# EAGLE schematic emonDCduo-ESP v4.1 (EAGLE 9.3.2)
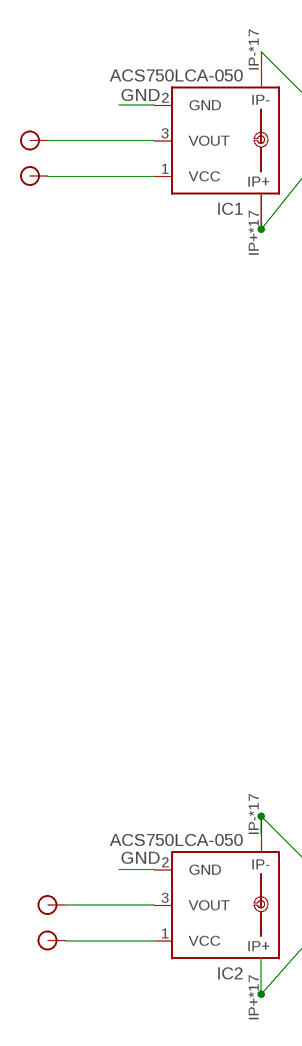
[diagram p0: schematic, sheet 1, part 1 of 2]
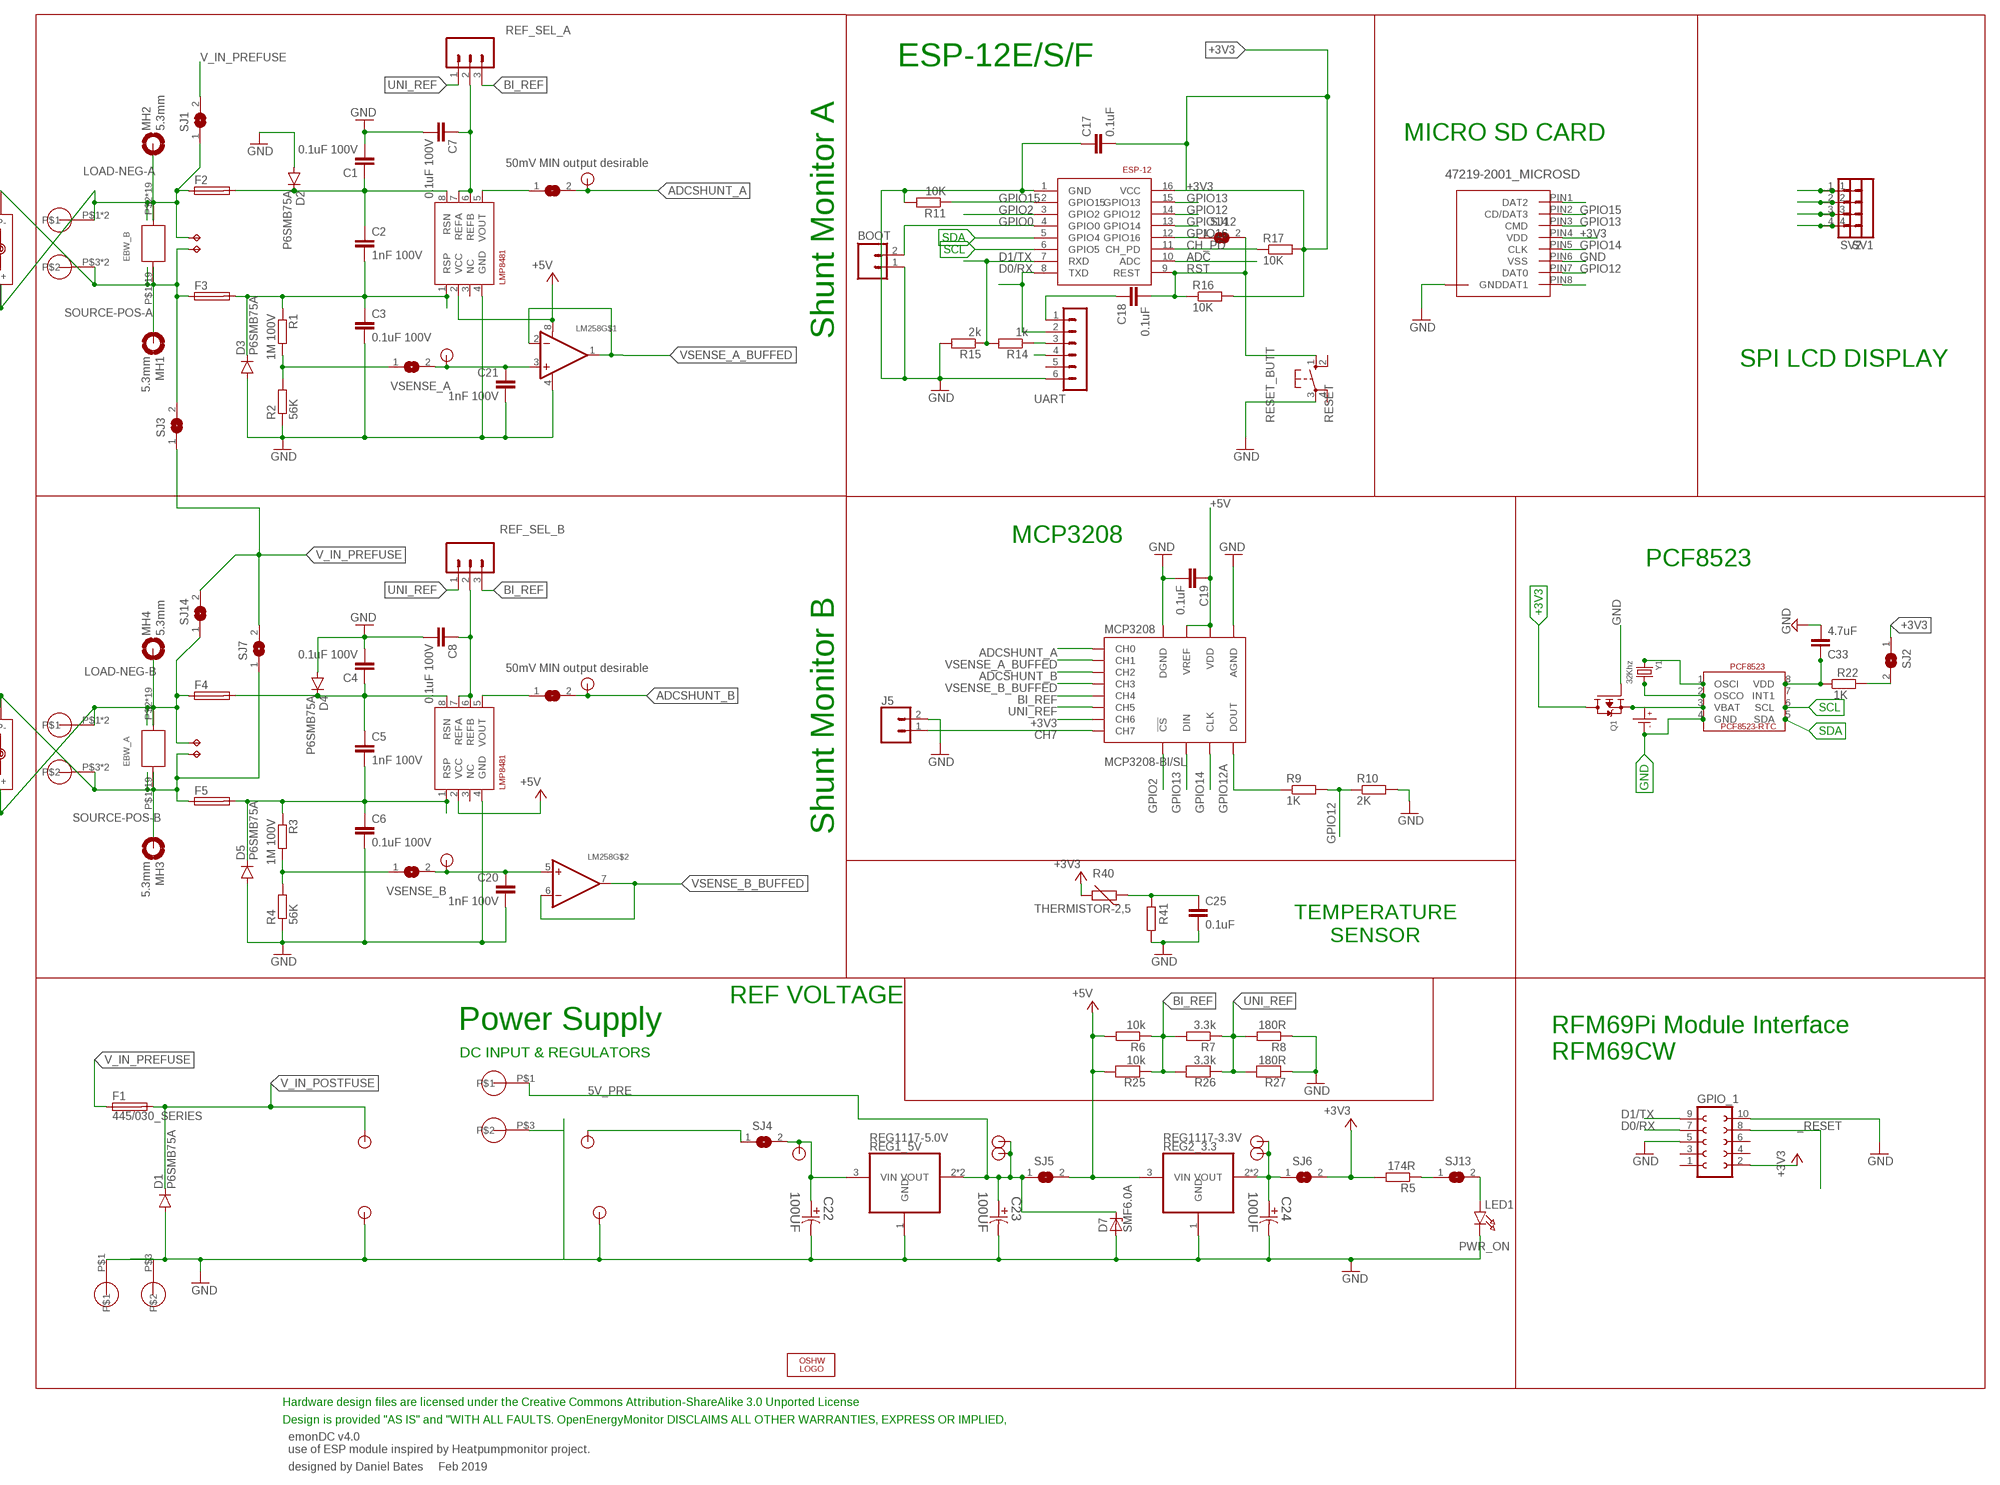
[diagram p1: schematic, sheet 1, part 2 of 2]

## Parts
BOOT  M02PTH  [1X02]
C1  0.1uF 100V  C-EUC0805  [C0805]
C2  1nF 100V  C-EUC0805  [C0805]
C3  0.1uF 100V  C-EUC0805  [C0805]
C4  0.1uF 100V  C-EUC0805  [C0805]
C5  1nF 100V  C-EUC0805  [C0805]
C6  0.1uF 100V  C-EUC0805  [C0805]
C7  0.1uF 100V  C-EUC0805  [C0805]
C8  0.1uF 100V  C-EUC0805  [C0805]
C17  0.1uF  C-EUC0805  [C0805]
C18  0.1uF  C-EUC0805  [C0805]
C19  0.1uF  C-EUC0805  [C0805]
C20  1nF 100V  C-EUC0805  [C0805]
C21  1nF 100V  C-EUC0805  [C0805]
C22  100UF  EEE-0JA101WAR-CASE-C  [CAPAE530X610N]
C23  100UF  EEE-0JA101WAR-CASE-C  [CAPAE530X610N]
C24  100UF  EEE-0JA101WAR-CASE-C  [CAPAE530X610N]
C25  0.1uF  C-EUC0805  [C0805]
C33  4.7uF  C-EUC0805  [C0805]
CR1220  CR1220SMD  [CR1220SMD]
D1  P6SMB75A  DIODE-DO214AA  [DO214AA]
D2  P6SMB75A  DIODE-SMB  [SMB]
D3  P6SMB75A  DIODE-SMB  [SMB]
D4  P6SMB75A  DIODE-SMB  [SMB]
D5  P6SMB75A  DIODE-SMB  [SMB]
D7  SMF6.0A  [SOD123F]
EBW_A  EBW_SERIES_15.2MM  [EBW_SERIES_15.2MM]
EBW_B  EBW_SERIES_15.2MM  [EBW_SERIES_15.2MM]
ESP-12  ESP8266_ESP-12  [ESP8266-ESP12]
F1  445/030_SERIES  [445/030_SERIES_LITTELFUSE]
F2  TR5  [TR5]
F3  TR5  [TR5]
F4  TR5  [TR5]
F5  TR5  [TR5]
GPIO_1  FE05-2_RFM69PI_OUTLINERFM69PI  [FE05-2_RFM69PI_OULTINE]
IC1  ACS750LCA-050  [ACS75050]
IC2  ACS750LCA-050  [ACS75050]
J5  CONN_02  [1X02]
LED1  PWR_ON  LED1206  [CHIPLED_1206]
LM258  LM358  [SOIC8_150MIL]
LOGO1  OSHW_LOGO_6MILX0200-NT  [OSHW_6X200_NOTEXT]
MCP3208  MCP3208-BI/SL  [SOIC16]
MH1  5.3mm  MOUNT-PAD-ROUND5.3  [5,3//11-PAD]
MH2  5.3mm  MOUNT-PAD-ROUND5.3  [5,3//11-PAD]
MH3  5.3mm  MOUNT-PAD-ROUND5.3  [5,3//11-PAD]
MH4  5.3mm  MOUNT-PAD-ROUND5.3  [5,3//11-PAD]
MICRO_SD  47219-2001_MICROSD  [47219-2001_MICROSD]
MOUNT_10.16_A  MOLEX_39970-003  [2/10,16]
MOUNT_10.16_B  MOLEX_39970-003  [2/10,16]
PCF8523  PCF8523_RTC  [SOIC_8]
Q1  MOSFET-P  [SOT23-R]
R1  1M 100V  R-EU_0207/2V  [0207/2V]
R2  56K  R-EU_0207/2V  [0207/2V]
R3  1M 100V  R-EU_0207/2V  [0207/2V]
R4  56K  R-EU_0207/2V  [0207/2V]
R5  174R  R-EU_R0603  [R0603]
R6  10k  R-EU_0207/10  [0207/10]
R7  3.3k  R-EU_0207/10  [0207/10]
R8  180R  R-EU_0207/10  [0207/10]
R9  1K  R-EU_R0603  [R0603]
R10  2K  R-EU_R0603  [R0603]
R11  10K  R-EU_R0603  [R0603]
R14  1k  R-EU_R0603  [R0603]
R15  2k  R-EU_R0603  [R0603]
R16  10K  R-EU_R0603  [R0603]
R17  10K  R-EU_R0603  [R0603]
R22  1K  R-EU_R0603  [R0603]
R25  10k  RESISTOR0603  [0603]
R26  3.3k  RESISTOR0603  [0603]
R27  180R  RESISTOR0603  [0603]
R40  THERMISTOR-2,5  [RS-2,5]
R41  R-EU_0207/2V  [0207/2V]
REF_SEL_A  455-1750-1-ND  CONN_03  [1X03]
REF_SEL_B  455-1750-1-ND  CONN_03  [1X03]
REG1_5V  REG1117-5.0V  REG1117  [SOT223]
REG2_3.3  REG1117-3.3V  REG1117  [SOT223]
RESET  RESET_BUTT  10-XX  [B3F-10XX]
SHUNTMON-A  LMP8481  LMP8481-H  [S-PDSO-G08]
SHUNTMON-B  LMP8481  LMP8481-H  [S-PDSO-G08]
SJ1  SJW  [SJW]
SJ2  SOLDERJUMPERCLOSED  [SOLDERJUMPER_CLOSEDWIRE]
SJ3  SJW  [SJW]
SJ4  SOLDERJUMPERCLOSED  [SOLDERJUMPER_CLOSEDWIRE]
SJ5  SOLDERJUMPERCLOSED  [SOLDERJUMPER_CLOSEDWIRE]
SJ6  SOLDERJUMPERCLOSED  [SOLDERJUMPER_CLOSEDWIRE]
SJ7  SJW  [SJW]
SJ8  SOLDERJUMPERCLOSED  [SOLDERJUMPER_CLOSEDWIRE]
SJ9  SOLDERJUMPERCLOSED  [SOLDERJUMPER_CLOSEDWIRE]
SJ10  SOLDERJUMPERCLOSED  [SOLDERJUMPER_CLOSEDWIRE]
SJ11  SOLDERJUMPERCLOSED  [SOLDERJUMPER_CLOSEDWIRE]
SJ12  SOLDERJUMPERCLOSED  [SOLDERJUMPER_CLOSEDWIRE]
SJ13  SOLDERJUMPERCLOSED  [SOLDERJUMPER_CLOSEDWIRE]
SJ14  SJW  [SJW]
SV1  MA04-1  [MA04-1]
SV2  MA04-1  [MA04-1]
TP8  TPPAD1-13Y  [P1-13Y]
TP9  TPPAD1-13Y  [P1-13Y]
TP10  TPPAD1-13Y  [P1-13Y]
TP11  TPPAD1-13Y  [P1-13Y]
U$1  TP0.8MM  [TP0.8]
U$2  2212S-02SG-85  TP_2_LONG  [TP0.8_X2]
U$3  2212S-02SG-85  TP_2_LONG  [TP0.8_X2]
U$4  TP0.8MM  [TP0.8]
U$5  TP0.8MM  [TP0.8]
U$6  TP0.8MM  [TP0.8]
U$7  TP0.8MM  [TP0.8]
U$8  TP0.8MM  [TP0.8]
U$9  TP0.8MM  [TP0.8]
U$10  2212S-02SG-85  TP_2_LONG  [TP0.8_X2]
U$11  2212S-02SG-85  TP_2_LONG  [TP0.8_X2]
U$12  5MMBLOCK  [2/5.08]
U$13  5MMBLOCK  [2/5.08]
U$14  TP0.8MM  [TP0.8]
U$15  TP0.8MM  [TP0.8]
U$16  TP0.8MM  [TP0.8]
U$17  TP0.8MM  [TP0.8]
U$18  TP0.8MM  [TP0.8]
U$19  TP0.8MM  [TP0.8]
UART  UART  MA06-1  [MA06-1]
Y1  32Khz  CRYSTAL8X3.8SMT  [CRYSTAL_8X3.8]

## Nets
3.3V_PRE [thin_power]: C24.1 REG2_3.3.2(VOUT) REG2_3.3.4(VOUT) SJ6.1 U$8.P$1 U$19.P$1
5V_PRE [thin_power]: C23.1 D7.C REG1_5V.2(VOUT) REG1_5V.4(VOUT) SJ5.1 U$7.P$1 U$12.P$1 U$18.P$1
6.5V [thin_power]: C22.1 REG1_5V.3(VIN) SJ4.2 U$9.P$1
+3V3 [thin_power2]: C17.2 ESP-12.16(VCC) GPIO_1.2 MCP3208.7(CH6) MICRO_SD.PIN4(VDD) Q1.3(D) R5.2 R16.2 R17.2 R40.2 SJ2.1 SJ6.2 SV1.3 SV2.3
+5V [thin_power2]: C19.1 LM258.8(V+) MCP3208.15(VREF) MCP3208.16(VDD) R6.2 R25.2 REG2_3.3.3(VIN) SHUNTMON-A.2(VCC) SHUNTMON-B.2(VCC) SJ5.2 UART.4
_RESET: GPIO_1.8
ADC: C25.1 ESP-12.10(ADC) R40.1 R41.2
ADCSHUNT_A: MCP3208.1(CH0) SJ11.2 U$6.P$1
ADCSHUNT_B: MCP3208.3(CH2) SJ10.2 U$5.P$1
BI_REF: MCP3208.5(CH4) R6.1 R7.2 R25.1 R26.2 REF_SEL_A.3 REF_SEL_B.3
CH7: J5.1 MCP3208.8(CH7)
CH_PD: ESP-12.11(CH_PD) R17.1
D0/RX: ESP-12.8(TXD) GPIO_1.7 UART.2
D1/TX: ESP-12.7(RXD) GPIO_1.9 R14.2 R15.1
GND: BOOT.1 C1.2 C3.2 C4.2 C6.2 C7.2 C8.2 C17.1 C19.2 C20.2 C21.2 C22.2 C23.2 C24.2 C25.2 C33.2 CR1220.P-(P$-) D1.A D2.A D3.A D4.A D5.A D7.A ESP-12.1(GND) GPIO_1.5 GPIO_1.10 IC1.2(GND) IC2.2(GND) J5.2 LED1.C LM258.4(V-) MCP3208.9(DGND) MCP3208.14(AGND) MICRO_SD.P$1(GND) MICRO_SD.P$2(GND) MICRO_SD.P$3(GND) MICRO_SD.P$4(GND) MICRO_SD.PIN6(VSS) PCF8523.4(GND) Q1.1(G) R2.1 R4.1 R8.1 R10.2 R11.2 R15.2 R27.1 R41.1 REG1_5V.1(GND) REG2_3.3.1(GND) RESET.3(P) SHUNTMON-A.4(GND) SHUNTMON-B.4(GND) SV1.4 SV2.4 U$3.P$1 U$3.P$2 U$11.P$1 U$11.P$2 U$12.P$3 U$13.P$1 U$13.P$3 UART.6
GPIO0: BOOT.2 ESP-12.4(GPIO0)
GPIO2: ESP-12.3(GPIO2) MCP3208.10(!CS)
GPIO12: ESP-12.14(GPIO12) MICRO_SD.PIN7(DAT0) R9.2 R10.1
GPIO12A: MCP3208.12(DOUT) R9.1
GPIO13: ESP-12.15(GPIO13) MCP3208.11(DIN) MICRO_SD.PIN3(CMD)
GPIO14: ESP-12.13(GPIO14) MCP3208.13(CLK) MICRO_SD.PIN5(CLK)
GPIO15: ESP-12.2(GPIO15) MICRO_SD.PIN2(CD/DAT3) R11.1
GPIO16: ESP-12.12(GPIO16) SJ12.1
LOAD-NEG-A [HV]: EBW_B.P$2 EBW_B.P$18 EBW_B.P$19 EBW_B.P$20 EBW_B.P$21 EBW_B.P$22 EBW_B.P$23 EBW_B.P$24 EBW_B.P$25 EBW_B.P$26 EBW_B.P$27 EBW_B.P$28 EBW_B.P$29 EBW_B.P$30 EBW_B.P$31 EBW_B.P$32 EBW_B.P$36 EBW_B.P$37 EBW_B.P$38 F2.1 IC1.IP+ IC1.IP+@2(IP+) IC1.IP+@3(IP+) IC1.IP+@4(IP+) IC1.IP+@5(IP+) IC1.IP+@6(IP+) IC1.IP+@7(IP+) IC1.IP+@8(IP+) IC1.IP+@9(IP+) IC1.IP+@10(IP+) IC1.IP+@11(IP+) IC1.IP+@12(IP+) IC1.IP+@13(IP+) IC1.IP+@14(IP+) IC1.IP+@15(IP+) IC1.IP+@16(IP+) IC1.IP+@17(IP+) MH2.B5,5(MOUNT) MOUNT_10.16_A.P$1 MOUNT_10.16_A.P$2 SJ1.1 TP11.TP
LOAD-NEG-A_T [thin_power]: C1.1 C2.1 D2.C F2.2 SHUNTMON-A.8(RSN)
LOAD-NEG-B [HV]: EBW_A.P$2 EBW_A.P$18 EBW_A.P$19 EBW_A.P$20 EBW_A.P$21 EBW_A.P$22 EBW_A.P$23 EBW_A.P$24 EBW_A.P$25 EBW_A.P$26 EBW_A.P$27 EBW_A.P$28 EBW_A.P$29 EBW_A.P$30 EBW_A.P$31 EBW_A.P$32 EBW_A.P$36 EBW_A.P$37 EBW_A.P$38 F4.1 IC2.IP+ IC2.IP+@2(IP+) IC2.IP+@3(IP+) IC2.IP+@4(IP+) IC2.IP+@5(IP+) IC2.IP+@6(IP+) IC2.IP+@7(IP+) IC2.IP+@8(IP+) IC2.IP+@9(IP+) IC2.IP+@10(IP+) IC2.IP+@11(IP+) IC2.IP+@12(IP+) IC2.IP+@13(IP+) IC2.IP+@14(IP+) IC2.IP+@15(IP+) IC2.IP+@16(IP+) IC2.IP+@17(IP+) MH4.B5,5(MOUNT) MOUNT_10.16_B.P$1 MOUNT_10.16_B.P$2 SJ14.1 TP9.TP
LOAD-NEG-B_T [thin_power]: C4.1 C5.1 D4.C F4.2 SHUNTMON-B.8(RSN)
N$1: C18.1 UART.1
N$5: R5.1 SJ13.1
N$6: LED1.A SJ13.2
N$7: MICRO_SD.PIN1(DAT2)
N$10: SHUNTMON-B.5(VOUT) SJ10.1
N$11: SHUNTMON-A.5(VOUT) SJ11.1
N$32: MICRO_SD.PIN8(DAT1)
N$36: R14.1 UART.3
N$44: PCF8523.2(OSCO) Y1.P$4
N$45: PCF8523.1(OSCI) Y1.P$1
REF_A_INPUT: C7.1 REF_SEL_A.2 SHUNTMON-A.6(REFB) SHUNTMON-A.7(REFA)
REF_B_INPUT: C8.1 REF_SEL_B.2 SHUNTMON-B.6(REFB) SHUNTMON-B.7(REFA)
RST: C18.2 ESP-12.9(REST) R16.1 RESET.1(S) SJ12.2
SCL: ESP-12.6(GPIO5) PCF8523.6(SCL) SV1.2 SV2.2
SDA: ESP-12.5(GPIO4) PCF8523.5(SDA) SV1.1 SV2.1
SOURCE-POS-A [HV]: EBW_B.P$1 EBW_B.P$3 EBW_B.P$4 EBW_B.P$5 EBW_B.P$6 EBW_B.P$7 EBW_B.P$8 EBW_B.P$9 EBW_B.P$10 EBW_B.P$11 EBW_B.P$12 EBW_B.P$13 EBW_B.P$14 EBW_B.P$15 EBW_B.P$16 EBW_B.P$17 EBW_B.P$33 EBW_B.P$34 EBW_B.P$35 F3.1 IC1.IP- IC1.IP-@2(IP-) IC1.IP-@3(IP-) IC1.IP-@4(IP-) IC1.IP-@5(IP-) IC1.IP-@6(IP-) IC1.IP-@7(IP-) IC1.IP-@8(IP-) IC1.IP-@9(IP-) IC1.IP-@10(IP-) IC1.IP-@11(IP-) IC1.IP-@12(IP-) IC1.IP-@13(IP-) IC1.IP-@14(IP-) IC1.IP-@15(IP-) IC1.IP-@16(IP-) IC1.IP-@17(IP-) MH1.B5,5(MOUNT) MOUNT_10.16_A.P$3 MOUNT_10.16_A.P$4 SJ3.2 TP10.TP
SOURCE-POS-A_T [thin_power]: C2.2 C3.1 D3.C F3.2 R1.1 SHUNTMON-A.1(RSP)
SOURCE-POS-B [HV]: EBW_A.P$1 EBW_A.P$3 EBW_A.P$4 EBW_A.P$5 EBW_A.P$6 EBW_A.P$7 EBW_A.P$8 EBW_A.P$9 EBW_A.P$10 EBW_A.P$11 EBW_A.P$12 EBW_A.P$13 EBW_A.P$14 EBW_A.P$15 EBW_A.P$16 EBW_A.P$17 EBW_A.P$33 EBW_A.P$34 EBW_A.P$35 F5.1 IC2.IP- IC2.IP-@2(IP-) IC2.IP-@3(IP-) IC2.IP-@4(IP-) IC2.IP-@5(IP-) IC2.IP-@6(IP-) IC2.IP-@7(IP-) IC2.IP-@8(IP-) IC2.IP-@9(IP-) IC2.IP-@10(IP-) IC2.IP-@11(IP-) IC2.IP-@12(IP-) IC2.IP-@13(IP-) IC2.IP-@14(IP-) IC2.IP-@15(IP-) IC2.IP-@16(IP-) IC2.IP-@17(IP-) MH3.B5,5(MOUNT) MOUNT_10.16_B.P$3 MOUNT_10.16_B.P$4 SJ7.1 TP8.TP
SOURCE-POS-B_T [thin_power]: C5.2 C6.1 D5.C F5.2 R3.1 SHUNTMON-B.1(RSP)
UNI_REF: MCP3208.6(CH5) R7.1 R8.2 R26.1 R27.2 REF_SEL_A.1 REF_SEL_B.1
V_IN_POSTFUSE [HV]: D1.C F1.P$3 F1.P$4 U$2.P$1 U$2.P$2
V_IN_PREFUSE [HV]: F1.P$1 F1.P$2 SJ1.2 SJ3.1 SJ7.2 SJ14.2
VBAT: CR1220.P+(P$+) PCF8523.3(VBAT) Q1.2(S)
VCC_ACS_A: IC1.1(VCC) U$17.P$1
VCC_ACS_B: IC2.1(VCC) U$15.P$1
VDD_PCF: C33.1 PCF8523.8(VDD) R22.1
VDD_RTC_POSTJUMPER: R22.2 SJ2.2
VOUT_ACS_A: IC1.3(VOUT) U$16.P$1
VOUT_ACS_B: IC2.3(VOUT) U$14.P$1
VOUT_POST_SWITCHING: SJ4.1 U$10.P$1 U$10.P$2
VSENSE_A: R1.2 R2.2 SJ8.1
VSENSE_A_BUFFED: LM258.1(OUT) LM258.2(-IN) MCP3208.2(CH1)
VSENSE_A_TP: C21.1 LM258.3(+IN) SJ8.2 U$1.P$1
VSENSE_B: R3.2 R4.2 SJ9.1
VSENSE_B_BUFFED: LM258.6(-IN) LM258.7(OUT) MCP3208.4(CH3)
VSENSE_B_TP: C20.1 LM258.5(+IN) SJ9.2 U$4.P$1
Unconnected: GPIO_1.1 GPIO_1.3 GPIO_1.4 GPIO_1.6 PCF8523.7(INT1) RESET.2(S1) RESET.4(P1) SHUNTMON-A.3(NC) SHUNTMON-B.3(NC) UART.5

## Notes on the sheet
- ESP-12E/S/F
- MICRO SD CARD
- 50mV MIN output desirable
- Shunt Monitor A
- SPI LCD DISPLAY
- MCP3208
- PCF8523
- 50mV MIN output desirable
- Shunt Monitor B
- TEMPERATURE
  SENSOR
- REF VOLTAGE
- Power Supply
- DC INPUT & REGULATORS
- RFM69Pi Module Interface
  RFM69CW
- Hardware design files are licensed under the Creative Commons Attribution-ShareAlike 3.0 Unported License
- Design is provided "AS IS" and "WITH ALL FAULTS. OpenEnergyMonitor DISCLAIMS ALL OTHER WARRANTIES, EXPRESS OR IMPLIED,
- emonDC v4.0
  use of ESP module inspired by Heatpumpmonitor project.
- designed by Daniel Bates     Feb 2019

## Library data of the parts
BOOT = SparkFun:M02: Header 2 Standard 2-pin 0.1" header. Use with straight break away headers (SKU : PRT-00116), right angle break away headers (PRT-00553), swiss pins (PRT-00743), machine pins (PRT-00117), and female headers (PRT-00115). Molex polarized connector foot print use with SKU : PRT-08233 with associated crimp pins and housings.
C1-C8 C20 C21 = rcl:C-EU: CAPACITOR, European symbol; MPN: C1608X7S2A104K080AB; SPICEPREFIX: C
C17-C19 C25 C33 = rcl:C-EU: CAPACITOR, European symbol; SPICEPREFIX: C
C22-C24 = Panasonic-EEE0_EEE1_EEE2_EEEFC:EEE-: Aluminum Electrolytic Capacitors,Surface Mount Type; MPN: EEE-0JA101WAR; OC_FARNELL: 2284723; OC_NEWARK: 53W3731; PACKAGE: CASE-C; SUPPLIER: PANASONIC; TOLERANCE: 20%; VOLTAGERATING: 6.3V
CR1220 = IotaWatt_parts:CR1220SMD: CR1220 Battery SMD; MPN: Harwin S8411-45R
D1-D5 = diode:DIODE-: DIODE
D7 = smf_10:SMF*A: SMF Series TVS Diodes Source: http://www.littelfuse.com/~/media/electronics/datasheets/tvs_diodes/littelfuse_tvs_diode_smf_datasheet.pdf.pdf; MF: Littelfuse; MPN: SMF6.0A; OC_FARNELL: unknown; OC_NEWARK: unknown
EBW_A EBW_B = EBW series SHUNT:EBW_SERIES_15.2MM
ESP-12 = ESP8266-ESP12:ESP8266_ESP-12
F1 = LITTELFUSE 455:030 SERIES:445/030_SERIES: MPN 04450001N
F2-F5 = fuse_db:TR5: FUSE Wickmann; MF: LITTELFUSE; MPN: 56000001009; OC_FARNELL: 1185363; OC_NEWARK: unknown
GPIO_1 = con-lsta-RFM69Pi:FE05-2_RFM69PI_OUTLINE: FEMALE HEADER
IC1 IC2 = allegro:ACS750*CA-050: Current Sensor display layer 49 Reference in BRD and place VIAs on circles Source: www.allegromicro.com/datafile/0750-050.pdf; MF: ALLEGRO MICROSYSTEMS, INC.; MPN: ACS750LCA-050; OC_FARNELL: 1457176; OC_NEWARK: 61H4464
J5 = SparkFun-Connectors:CONN_02: Multi connection point. Often used as Generic Header-pin footprint for 0.1 inch spaced/style header connections On any of the 0.1 inch spaced packages, you can populate with these: Break Away Headers - Straight <https://www.sparkfun.com/products/116> (PRT-00116) Break Away Male Headers - Right Angle <https://www.sparkfun.com/products/553> (PRT-00553) Female Headers <https://www.sparkfun.com/products/115> (PRT-00115) Break Away Headers - Machine Pin <https://www.sparkfun.com/products/117> (PRT-00117) Break Away Female Headers - Swiss Machine Pin <https://www.sparkfun.com/products/743> (PRT-00743) For SCREWTERMINALS and SPRING TERMINALS visit here: Screw Terimnals on SparkFun.com <https://www.sparkfun.com/search/results?term=Screw+Terminals> (5mm/3.5mm/2.54mm spacing) This device is also useful as a general connection point to wire up your design to another part of your project. Our various solder wires solder well into these plated through hole pads. Hook-Up Wire - Assortment (Stranded, 22 AWG) <https://www.sparkfun.com/products/11375> (PRT-11375) Hook-Up Wire - Assortment (Solid Core, 22 AWG) <https://www.sparkfun.com/products/11367> (PRT-11367) View the entire wire category on our website here <https://www.sparkfun.com/categories/141> Special notes: Molex polarized connector foot print use with: PRT-08233 with associated crimp pins and housings. 2.54_SCREWTERM for use with PRT-10571. 3.5mm Screw Terminal footprints for PRT-08084 5mm Screw Terminal footprints for use with PRT-08432
LED1 = microbuilder:LED: LED 0603 - 0603 Surface Mount Package 2mA: Green LED - Low Power (3.9mcd, 2ma, 1.7Vf) - Digikey: 475-2709-2-ND Orange LED - Low Power (9.8mcd, 2ma, 1.8Vf) - Digikey: 475-1194-2-ND Red LED - Low Power (5mcd, 2ma, 1.8Vf) - Digikey: 475-1195-2-ND Yellow LED - Low Power (7mcd, 2ma, 1.8Vf) - Digikey: 475-1196-2-ND 5mA: Blue LED - Low Power (17mcd, 5ma, 2.9Vf) - Digikey: LNJ937W8CRACT-ND 0805 - 0805 Surface Mount Package 2mA: Red LED (8.8mcd, 2mA, 1.8Vf, Clear) - Low Power [Digikey: 475-2510-1-ND] Green LED (5mcd, 2mA, 1.8Vf, Clear) - Low Power [Digikey: 475-2730-1-ND] Yellow LED (11.3mcd, 2mA, 1.8Vf, Clear) - Low Power [Digikey: 475-2555-1-ND] 20mA: Red LED (104mcd, 20mA, Diffused) - LS R976 [Digikey: 475-1278-6-ND] Red LED (12mcd, 20mA, 2.0Vf, Clear) - APT2012EC [Digikey: 754-1128-1-ND] Green LED (15mcd, 20mA, 2.2Vf, Clear) - APT2012GC [Digikey: 754-1131-1-ND] Orange LED (160mcd, 20mA, 2.1Vf, Clear) - APT2012SECK [Digikey: 754-1130-1-ND] 1206 - 1206 Surface Mount Package Green LED (26mcd, 20mA, Diffused) - LG N971 [Digikey: 475-1407-6-ND] Red LED (15mcd, 20mA, Diffused) - LH N974 [Digikey: 475-1416-6-ND]
LM258 = microbuilder:LM358: LM358 Dual Operational Amplifier Digikey: LM358AMXFSCT-ND
LOGO1 = ohw-logo:OSHW_LOGO_6MIL; OC_FARNELL: unknown
MCP3208 = MCP3208:MCP3208
MH1-MH4 = holes-db:MOUNT-PAD-ROUND: MOUNTING PAD, round
MICRO_SD = MOLEX 47219-2001:47219-2001_MICROSD
MOUNT_10.16_A MOUNT_10.16_B = 10.16mm terminal block:MOLEX_39970-003
PCF8523 = emonDC parts:PCF8523_RTC: PCF8523-RTC SOIC-8
Q1 = microbuilder:MOSFET-P: P-Channel Mosfet LEGEND VDS: Voltage Drain-Source ID: Drain Current RDS(ON): Drain-Source On-State Resistance VGS(TH): Gate-Source Threshold Voltage CISS: Drain-Source Input Capacitance SOT-23 Name VDS ID RDS(ON) VGS(TH) CISS Order Number IRLML5103 30V 760mA 600 mOhm -- 75pF @ 25V Digikey: IRLML5103PBFCT-ND IRLML6401 12V 4.3A 50 mOhm 950mV @ 250µA 830pF @ 10V Digikey: IRLML6401PBFTR-ND NTR0202PL 20V 400mA 800 mOhm 2.3V @ 250uA 70pF @ 5V Digikey: NTR0202PLT1GOSTR-ND NTR4101PT1G 20V 1.8A 85 mOhm 1.2V @ 250uA 675pF @ 10V Digikey: NTR4101PT1GOSCT-ND DMP2004K 20V 600mA 900 mOhm 1V @ 250uA 175pF @ 16V Digikey: DMP2004KDICT-ND PMV65XP 20V 3.9A 76 mOhm 950mV @ 1mA 725pF @ 20V Digikey: 568-2358-2-ND TO-252 Name VDS ID RDS(ON) VGS(TH) CISS Order Number AOD417 30V 25A 34 mOhm 3V @ 250µA 920pF @ 15V Digikey: 785-1106-2-ND
R1 R3 = rcl7:R-EU_: RESISTOR, European symbol; MPN: MCMF006FF1004A50
R2 R4 = rcl7:R-EU_: RESISTOR, European symbol; MPN: MCMF006FF7502A50
R5 = rcl:R-EU_: RESISTOR, European symbol; SPICEPREFIX: R
R6-R8 R41 = rcl7:R-EU_: RESISTOR, European symbol
R9 R10 = rcl:R-EU_: RESISTOR, European symbol; MPN: MCWR06X5901FTL
R11 R14-R17 = rcl:R-EU_: RESISTOR, European symbol
R22 = rcl@1:R-EU_: RESISTOR, European symbol
R25-R27 = microbuilder:RESISTOR: Resistors 0402 - 0402 Surface Mount Package 22 Ohm 1% 1/16W [Digikey: 311-22.0LRTR-ND] 33 Ohm 5% 1/16W 1.0K 5% 1/16W 1.5K 5% 1/16W 2.0K 1% 1/16W 10.0K 1% 1/16W [Digikey: 311-10.0KLRTR-ND] 10.0K 5% 1/16W [Digikey: RMCF0402JT10K0TR-ND] 12.1K 1% 1/16W [Digikey: 311-22.0LRTR-ND] 100.0K 5% 1/16W 0603 - 0603 Surface Mount Package 0 Ohm 1/10 Watt 1% Resistor 15 Ohm 1/10 Watt 1% Resistor 33 Ohm 1/10 Watt 1% Resistor 49.9 Ohm 1/10 Watt 1% Resistor 100 Ohm 1/10 Watt 1% Resistor 150 Ohm 1/10 Watt 1% Resistor 240 Ohm 1/10 Watt 1% Resistor 390 Ohm 1/10 Watt 1% Resistor 560 Ohm 1/10 Watt 1% Resistor 680 Ohm 1/10 Watt 1% Resistor 750 Ohm 1/10 Watt 1% Resistor 1.0K Ohm 1/10 Watt 1% Resistor 1.5K Ohm 1/10 Watt 1% Resistor 2.0K Ohm 1/10 Watt 1% Resistor 2.2K Ohm 1/10 Watt 1% Resistor 3.3K Ohm 1/10 Watt 1% Resistor 4.7K Ohm 1/10 Watt 1% Resistor 10.0K Ohm 1/10 Watt 1% Resistor 12.0K Ohm 1/10 Watt 1% Resistor 12.1K Ohm 1/10 Watt 1% Resistor 20.0K Ohm 1/10 Watt 1% Resistor 33.0K Ohm 1/10 Watt 1% Resistor 100.0K Ohm 1/10 Watt 1% Resistor 0805 - 0805 Surface Mount Package 0 Ohm 1/8 Watt 1% Resistor 33 Ohm 1/8 Watt 1% Resistor 100 Ohm 1/8 Watt 1% Resistor 150 Ohm 1/8 Watt 1% Resistor 200 Ohm 1/8 Watt 1% Resistor 240 Ohm 1/8 Watt 1% Resistor 330 Ohm 1/8 Watt 1% Resistor 390 Ohm 1/8 Watt 1% Resistor 470 Ohm 1/8 Watt 1% Resistor 1.0K Ohm 1/8 Watt 1% Resistor 1.5K Ohm 1/8 Watt 1% Resistor 2.0K Ohm 1/8 Watt 1% Resistor 4.7K Ohm 1/8 Watt 1% Resistor 5.1K Ohm 1/8 Watt 1% Resistor 5.6K Ohm 1/8 Watt 1% Resistor 10.0K Ohm 1/8 Watt 1% Resistor 22.0K Ohm 1/8 Watt 1% Resistor 33.0K Ohm 1/8 Watt 1% Resistor 100K Ohm 1/8 Watt 1% Resistor 1206 - 1206 Surface Mount Package 2012 - 2010 Surface Mount Package 0.11 Ohm 1/2 Watt 1% Resistor - Digikey: RHM.11UCT-ND
R40 = varistor:THERMISTOR: THERMISTOR
REF_SEL_A REF_SEL_B = SparkFun-Connectors:CONN_03: Multi connection point. Often used as Generic Header-pin footprint for 0.1 inch spaced/style header connections On any of the 0.1 inch spaced packages, you can populate with these: Break Away Headers - Straight <https://www.sparkfun.com/products/116> (PRT-00116) Break Away Male Headers - Right Angle <https://www.sparkfun.com/products/553> (PRT-00553) Female Headers <https://www.sparkfun.com/products/115> (PRT-00115) Break Away Headers - Machine Pin <https://www.sparkfun.com/products/117> (PRT-00117) Break Away Female Headers - Swiss Machine Pin <https://www.sparkfun.com/products/743> (PRT-00743) Stackable Header - 3 Pin (Female, 0.1") <https://www.sparkfun.com/products/13875> (PRT-13875) For SCREWTERMINALS and SPRING TERMINALS visit here: Screw Terimnals on SparkFun.com <https://www.sparkfun.com/search/results?term=Screw+Terminals> (5mm/3.5mm/2.54mm spacing) This device is also useful as a general connection point to wire up your design to another part of your project. Our various solder wires solder well into these plated through hole pads. Hook-Up Wire - Assortment (Stranded, 22 AWG) <https://www.sparkfun.com/products/11375> (PRT-11375) Hook-Up Wire - Assortment (Solid Core, 22 AWG) <https://www.sparkfun.com/products/11367> (PRT-11367) View the entire wire category on our website here <https://www.sparkfun.com/categories/141> Special notes: Molex polarized connector foot print use with SKU : PRT-08232 with associated crimp pins and housings.; MF: MULTICOMP; MPN: 2212S-02SG-85; OC_FARNELL: 1593458; PROD_ID: XXX-00000
REG1_5V = burr-brown-db:REG1117: 800mA and 1A Low Dropout (LDO) Positive Regulator 1.8V, 2.5V, 2.85V, 3.3V, 5V, and Adj; MF: TEXAS INSTRUMENTS; MPN: REG1117-5.0; OC_FARNELL: 1097566; OC_NEWARK: 14P6981
REG2_3.3 = burr-brown-db:REG1117: 800mA and 1A Low Dropout (LDO) Positive Regulator 1.8V, 2.5V, 2.85V, 3.3V, 5V, and Adj; MF: TEXAS INSTRUMENTS; MPN: REG1117-3.3; OC_FARNELL: 1097566; OC_NEWARK: 14P6981
RESET = switch-omron:10-XX: OMRON SWITCH; MPN: FSM4JH; OC_FARNELL: 155598
SHUNTMON-A = lmp8481b:LMP8481: LMP8481MM-H/NOPB 100V/V; MF: TEXAS INSTRUMENTS; MPN: LMP8481MME-S/NOPB; OC_FARNELL: 2322044
SHUNTMON-B = lmp8481b:LMP8481: LMP8481MM-H/NOPB 100V/V; MF: TEXAS INSTRUMENTS; MPN: LMP8481MME-H/NOPB; OC_FARNELL: 2322044
SJ1 SJ3 SJ7 SJ14 = jumper:SJ: SMD solder JUMPER
SJ2 SJ4-SJ6 SJ8-SJ13 = microbuilder:SOLDERJUMPER: SMD Solder JUMPER Solder the two pads together to create a connection, or remove the solder to break it. REFLOW - Use this footprint for solder paste and reflow ovens. WAVE - Use this footprint for hand-soldering (larger pads). CLOSED - Has a trace between the two pads to ensure it is closed by default. The trace needs to be cut to disable the jumper, and can be closed again by creating a solder bridge between the two pads.
SV1 SV2 = con-lstb-db:MA04-1: PIN HEADER; MF: MULTICOMP; MPN: 2212S-04SG-85; OC_FARNELL: 1593460; OC_NEWARK: unknown
TP8-TP11 = testpad:TP: Test pad
U$1 U$4-U$9 U$14-U$19 = testpad_db:TP
U$2 U$3 U$10 U$11 = testpad_db:TP_2_LONG; MPN: 2212S-02SG-85
U$12 U$13 = 5mm terminal block:5MMBLOCK; MF: LUMBERG; MPN: KRM_02; OC_FARNELL: 1177875
UART = JeeLabs:MA06-1: PIN HEADER
Y1 = microbuilder:CRYSTAL: Crystals HC49UP - Surface Mount Crystal 4.0MHz 18pF +/-30ppm Surface Mount Crystal [Digikey: 535-9857-1-ND] 12.0 MHz Surface Mount Crystal [Digikey: 535-9869-6-ND] 25.0 MHz Surface Mount Crystal [Digikey: 535-9078-1-ND] 2.5 x 2.0mm - MEMs SMT Crystal 16.0 MHz 10pF 20ppm 2.5 x 2.0mm Crystal [Digikey -40-85°C: 535-10923-1-ND] 3.2 x 2.5mm - MEMs SMT Crystal 12.0 MHz 8pF 15ppm 3.2 x 2.5mm Crystal [Digikey: -10-70°C: 644-1047-1-ND -40-125°C: 644-1128-1-ND] 16.0 MHz 8pF 15ppm 3.2 x 2.5mm Crystal [Digikey: -10-70°C: 644-1049-1-ND -40-125°C: 644-1129-2-ND] 16.0 MHz 10pF 10ppm 3.2 x 2.5mm Crystal [Digikey: 644-1100-1-ND] 27.12 MHz 18pF 30ppm 3.2 x 2.5mm Crystal [Digikey: 887-1424-1-ND] 27.12MHz 10pF 10ppm 3.2 x 2.5mm Crystal [Digikey: 887-1329-1-ND] 4.9 x 1.8mm - MEMs SMT Crystal 32.768 KHz 12.5pF 20ppm 4.9 x 1.8mm Crystal [Digikey: SE2415CT-ND] 8.0 x 3.8mm - Surface Mount Crystal 32.768kHz 12.5pF 20ppm -40°C-85°C [Digikey: 535-9166-2-ND] Cylinder 32.768KHz Cylinder Crystal (2x6mm body) [Ex. Digikey: 300-8341-2-ND]

## Net classes
0 default: clearance 0.254 mm
1 power: width 0.254 mm, clearance 0.254 mm
2 thin_power: width 0.254 mm, clearance 0.254 mm
3 thin_power2: width 0.254 mm, clearance 0.254 mm
4 HV: clearance 0.762 mm